# Altium schematic sheet Potentiometer.SchDoc
size 45 x 25 mm
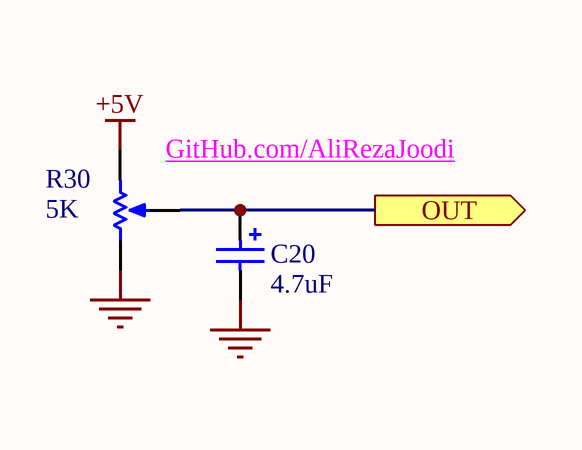
[diagram p0: Potentiometer.SchDoc]

## Parts
C20  value 4.7uF  [CAPPR2.5-6.3x5]  (hidden comment: C18)
R30  value 5K  [VR4_]  (hidden comment: POT)

## Ports
OUT (out)

## Nets
+5V: R30.2(BOT)
GND: C20.2 R30.1(TOP)
OUT: C20.1 R30.3(TAP) ; port OUT

## Notes on the sheet
- (near R30) GitHub.com/AliRezaJoodi

## Library data of the parts
C20 = Cap Pol1: Polarized Capacitor (Radial); Manufacturer: Generic Components; Class I: Passive; Published: 8-Jun-2000; Revision: July-2002: Re-released for DXP Platform.; Publisher: Altium Limited; Class II: Capacitor
R30 = RPot1: Potentiometer; Manufacturer: Generic Components; Class I: Passive; Set Position: 0.5; Published: 8-Jun-2000; Revision: July-2002: Re-released for DXP Platform.; Publisher: Altium Limited; Class II: Potentiometer